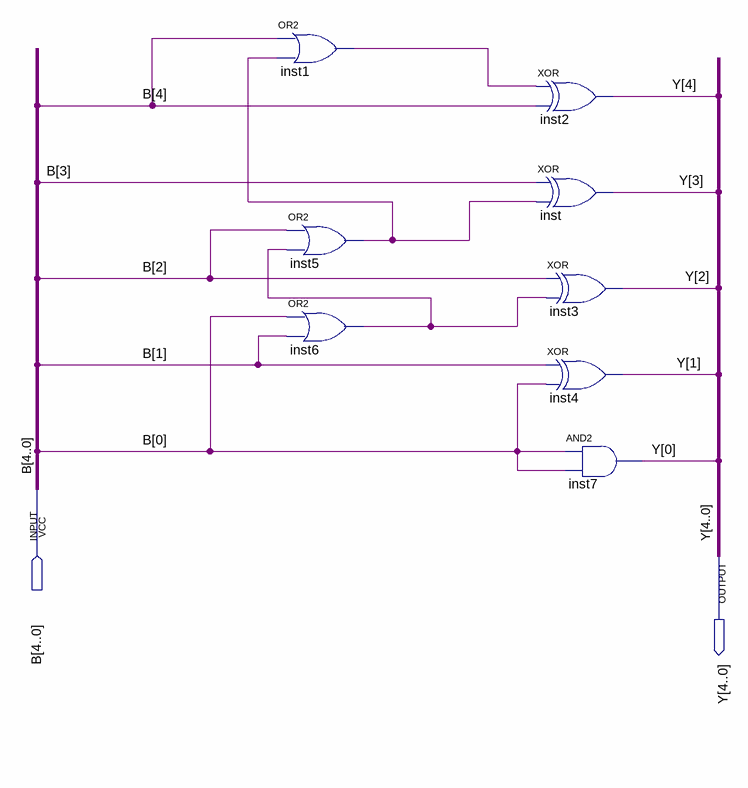
[diagram p0: schematic sheet]
// Quartus schematic Complemento2deB.bdf as structural Verilog: 8 symbols, 2 pins
module Complemento2deB (
  input  [4:0] B,
  output [4:0] Y
);

  wire inst1_out, inst5_out, inst6_out;

  or inst1 (inst1_out, B[4], inst5_out);
  or inst5 (inst5_out, B[2], inst6_out);
  or inst6 (inst6_out, B[0], B[1]);
  xor inst2 (Y[4], inst1_out, B[4]);
  xor inst (Y[3], B[3], inst5_out);
  xor inst3 (Y[2], B[2], inst6_out);
  xor inst4 (Y[1], B[1], B[0]);
  and inst7 (Y[0], B[0], B[0]);
endmodule
